# Altium schematic sheet Analog.SchDoc: Level shifters + Amplifiers
size A4; Date: 6.4.2015; Engineer: Matjaz Tome; DocumentNumber: 6; Revision: B1; SheetNumber: 6; SheetTotal: 8; Project: USB DAQ
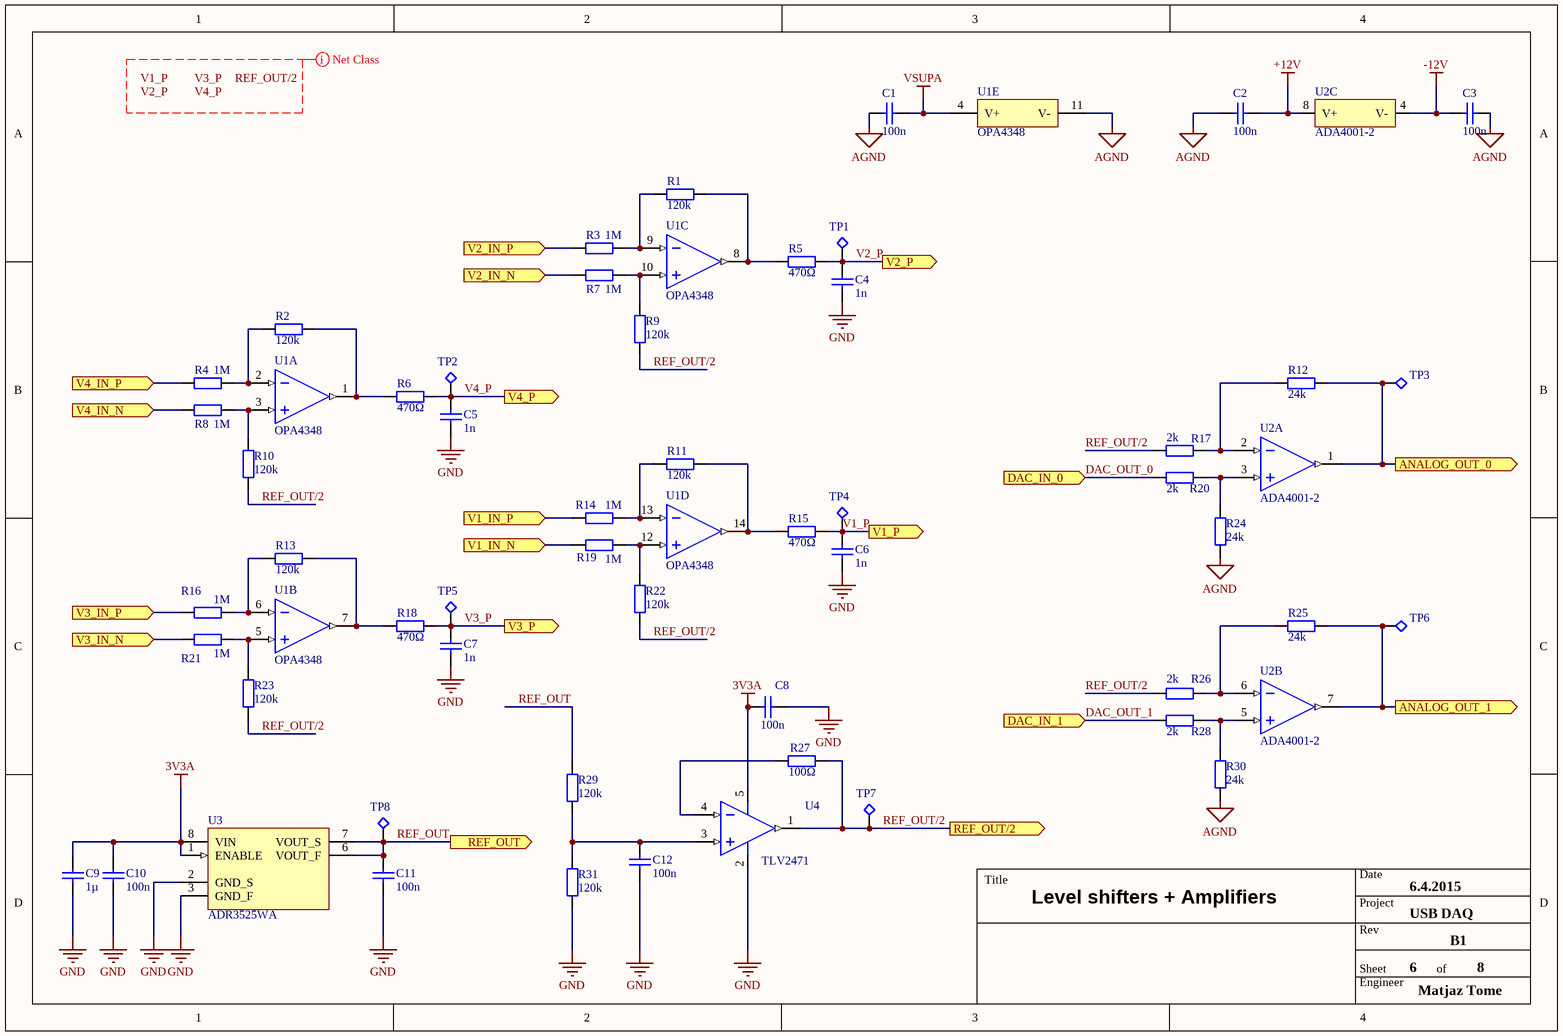
[diagram p0: Analog.SchDoc]

## Parts
C1  100n  [0603C]
C2  100n  [0603C]
C3  100n  [0603C]
C4  1n  [0603C]
C5  1n  [0603C]
C6  1n  [0603C]
C7  1n  [0603C]
C8  100n  [0603C]
C9  1µ  [0603C]
C10  100n  [0603C]
C11  100n  [0603C]
C12  100n  [0603C]
R1  120k  [0603R]
R2  120k  [0603R]
R3  1M  [0603R]
R4  1M  [0603R]
R5  470Ω  [0603R]
R6  470Ω  [0603R]
R7  1M  [0603R]
R8  1M  [0603R]
R9  120k  [0603R]
R10  120k  [0603R]
R11  120k  [0603R]
R12  24k  [0603R]
R13  120k  [0603R]
R14  1M  [0603R]
R15  470Ω  [0603R]
R16  1M  [0603R]
R17  2k  [0603R]
R18  470Ω  [0603R]
R19  1M  [0603R]
R20  2k  [0603R]
R21  1M  [0603R]
R22  120k  [0603R]
R23  120k  [0603R]
R24  24k  [0603R]
R25  24k  [0603R]
R26  2k  [0603R]
R27  100Ω  [0603R]
R28  2k  [0603R]
R29  120k  [0603R]
R30  24k  [0603R]
R31  120k  [0603R]
TP1  testpoint  [TP1_FULL]  (value not drawn)  (no BOM)
TP2  testpoint  [TP1_FULL]  (value not drawn)  (no BOM)
TP3  testpoint  [TP1_FULL]  (value not drawn)  (no BOM)
TP4  testpoint  [TP1_FULL]  (value not drawn)  (no BOM)
TP5  testpoint  [TP1_FULL]  (value not drawn)  (no BOM)
TP6  testpoint  [TP1_FULL]  (value not drawn)  (no BOM)
TP7  testpoint  [TP1_FULL]  (value not drawn)  (no BOM)
TP8  testpoint  [TP1_FULL]  (value not drawn)  (no BOM)
U1  OPA4348  [SOIC14]  (parts A,B,C,D,E of 5)
U2  ADA4001-2  [SOIC8]  (parts A,B,C of 3)
U3  ADR3525WA  [MSOP8]
U4  TLV2471  [SOT23-5]

## Ports
ANALOG_OUT_0 (out), ANALOG_OUT_1 (out), DAC_IN_0 (in), DAC_IN_1 (in), REF_OUT (out), REF_OUT/2 (out), V1_IN_N (in), V1_IN_P (in), V1_P (out), V2_IN_N (in), V2_IN_P (in), V2_P (out), V3_IN_N (in), V3_IN_P (in), V3_P (out), V4_IN_N (in), V4_IN_P (in), V4_P (out)

## Nets
3V3A: C8.2 C9.2 C10.2 U3.1(ENABLE) U3.8(VIN) U4.5(V+)
+12V: C2.1 U2.8(V+)
-12V: C3.2 U2.4(V-)
AGND: C1.2 C2.2 C3.1 R24.1 R30.1 U1.11(V-)
GND: C4.1 C5.1 C6.1 C7.1 C8.1 C9.1 C10.1 C11.1 C12.1 R31.1 U3.2(GND_S) U3.3(GND_F) U4.2(V-)
VSUPA: C1.1 U1.4(V+)
ANALOG_OUT_0: R12.2 TP3.1 U2.1(OUT) ; port ANALOG_OUT_0
ANALOG_OUT_1: R25.1 TP6.1 U2.7(OUT) ; port ANALOG_OUT_1
DAC_OUT_0: R20.1 ; port DAC_IN_0
DAC_OUT_1: R28.1 ; port DAC_IN_1
REF_OUT: C11.2 R29.2 TP8.1 U3.6(VOUT_F) U3.7(VOUT_S) ; port REF_OUT
REF_OUT/2: R9.1 R10.1 R17.1 R22.1 R23.1 R26.1 R27.2 TP7.1 U4.1(OUT_A) ; port REF_OUT/2
V1_IN_N: R19.1 ; port V1_IN_N
V1_IN_P: R14.1 ; port V1_IN_P
V1_P: C6.2 R15.2 TP4.1 ; port V1_P
V2_IN_N: R7.1 ; port V2_IN_N
V2_IN_P: R3.1 ; port V2_IN_P
V2_P: C4.2 R5.2 TP1.1 ; port V2_P
V3_IN_N: R21.1 ; port V3_IN_N
V3_IN_P: R16.1 ; port V3_IN_P
V3_P: C7.2 R18.2 TP5.1 ; port V3_P
V4_IN_N: R8.1 ; port V4_IN_N
V4_IN_P: R4.1 ; port V4_IN_P
V4_P: C5.2 R6.2 TP2.1 ; port V4_P
NetC12_2: C12.2 R29.1 R31.2 U4.3(+IN_A)
NetR1_1: R1.1 R3.2 U1.9(-IN_C)
NetR1_2: R1.2 R5.1 U1.8(OUT_C)
NetR2_1: R2.1 R4.2 U1.2(-IN_A)
NetR2_2: R2.2 R6.1 U1.1(OUT_A)
NetR7_2: R7.2 R9.2 U1.10(+IN_C)
NetR8_2: R8.2 R10.2 U1.3(+IN_A)
NetR11_1: R11.1 R14.2 U1.13(-IN_D)
NetR11_2: R11.2 R15.1 U1.14(OUT_D)
NetR12_1: R12.1 R17.2 U2.2(IN-)
NetR13_1: R13.1 R16.2 U1.6(-IN_B)
NetR13_2: R13.2 R18.1 U1.7(OUT_B)
NetR19_2: R19.2 R22.2 U1.12(+IN_D)
NetR20_2: R20.2 R24.2 U2.3(IN+)
NetR21_2: R21.2 R23.2 U1.5(+IN_B)
NetR25_2: R25.2 R26.2 U2.6(IN2-)
NetR27_1: R27.1 U4.4(-IN_A)
NetR28_2: R28.2 R30.2 U2.5(IN2+)

## Layout directives
net class ANALOG: REF_OUT/2, V1_P, V2_P, V3_P, V4_P

## Notes on the sheet
- Labels drawn without touching a wire or pin: REF_OUT/2, V1_P, V2_P, V3_P, V4_P
- Title
- Date
- Project
- Rev
- Engineer
- Sheet
- of

## Library data of the parts
C1-C3 C8 C10-C12 = RSC0013: ceramic X7R SMD capacitor smd 0603 100nF 16V; Manufacturer: Murata; Manufacturer Number: GRM188R71C104KA01D; Dealer number: 1828890; Dealer: Farnell; Tolerance: 10%; Part Number: RSC0013; Category: capacitors; Price: 0.042; Value: 100nF; Voltage: 16V; Case: 0603; Technology: SMT; Dielectric: X7R; HelpURL: U:\datasheet\cap\Murata\GRM\GRM188R71C104KA01D.pdf; Supplier 1: Farnell; Supplier Part Number 1: 1828890
C4-C7 = RSC0016: ceramic X7R SMD capacitor smd 0603 1nF 100V; Manufacturer: Kemet; Manufacturer Number: C0603C102K1RACTU; Dealer number: 1414606; Dealer: Farnell; Tolerance: 10%; Part Number: RSC0016; Category: capacitors; Price: 0.039; Value: 1nF; Voltage: 100V; Case: 0603; Technology: SMT; Dielectric: X7R; HelpURL: U:\datasheet\cap\KEMET X7R SMD.pdf; Supplier 1: Farnell; Supplier Part Number 1: 1414606; SKU: 1020100000013
C9 = ZSC0003: ceramic X5R SMD capacitor smd 0603 1µF 50V; Manufacturer: Murata; Manufacturer Number: GRM188R61H105KAALD; Tolerance: 10%; Part Number: ZSC0003; Category: capacitors; Price: 0.144; Value: 1µF; Voltage: 50V; Case: 0603; Technology: SMT; Dielectric: X5R; HelpURL: U:\datasheet\cap\Murata\GRM\GRM188R61H105KAALD.pdf; SKU: 1020300000001; Supplier part number 1: 1845736; Supplier 1: Farnell
R1 R2 R9-R11 R13 R22 R23 R29 R31 = ZRS0007: resistor smd 0603 120kΩ 0.1% 0.1w; Manufacturer: Panasonic; Manufacturer Number: ERA3AEB124V; Temperature coefficient: 25ppm; Part Number: ZRS0007; Category: resistors; Price: 0.26; Value: 120KΩ; Power: 0.1W; Tolerance: 0.1%; Case: 0603; Technology: SMT; Material: Metal film - thin / Metal film; HelpURL: U:\datasheet\res\PANASONIC_ERA.pdf; Supplier part number 1: 1577634; Supplier 1: Farnell
R3 R4 R7 R8 R14 R16 R19 R21 = ZRS0005: resistor smd 0603 1MΩ 0.1% 0.1w; Manufacturer: TE Connectivity; Manufacturer Number: CPF0603B1M0E1; Temperature coefficient: 25ppm; Part Number: ZRS0005; Category: resistors; Price: 0.36; Value: 1MΩ; Power: 0.1W; Tolerance: 0.1%; Case: 0603; Technology: SMT; Material: Metal film - thin / Metal film; HelpURL: U:\datasheet\res\TE_CONNECTIVITY_CPF.pdf; Supplier part number 1: 2331023; Supplier 1: Farnell
R5 R6 R15 R18 = XRS0039: resistor smd 0603 470Ω 5% 0.1w; Manufacturer: Multicomp; Manufacturer Number: MCMR06X471 JTL; Temperature coefficient: 100ppm; Part Number: XRS0039; Category: resistors; Price: 0.009€; Value: 470Ω; Power: 0.1W; Tolerance: 5%; Case: 0603; Technology: SMT; Material: Metal film / Metal film; HelpURL: U:\datasheet\res\MULTICOMP 0603.pdf; Supplier part number 1: 2073513; Supplier 1: Farnell
R12 R24 R25 R30 = ZRS0008: resistor smd 0603 24kΩ 0.1% 0.1w; Manufacturer: Welwyn; Manufacturer Number: PCF0603P-R-24K-BT1; Temperature coefficient: 25ppm; Part Number: ZRS0008; Category: resistors; Price: 0.194; Value: 24KΩ; Power: 0.1W; Tolerance: 0.1%; Case: 0603; Technology: SMT; Material: Metal film - thin / Metal film; HelpURL: U:\datasheet\res\WELW.pdf; Supplier part number 1: 1506034; Supplier 1: Farnell
R17 R20 R26 R28 = ZRS0001: resistor smd 0603 2kΩ 0.1% 0.1w; Manufacturer: Susumu; Manufacturer Number: RR0816P-202-B-T5; Temperature coefficient: 25ppm; Part Number: ZRS0001; Category: resistors; Price: 0.098; Value: 2KΩ; Power: 0.1W; Tolerance: 0.1%; Case: 0603; Technology: SMT; Material: Metal film - thin / Metal film; HelpURL: U:\datasheet\res\SUSUMU_RR.pdf; Supplier part number 1: 1653263; Supplier 1: Farnell
R27 = XRS0016: resistor smd 0603 100Ω 5% 0.1w; Manufacturer: Multicomp; Manufacturer Number: MCMR06X101 JTL; Temperature coefficient: 100ppm; Part Number: XRS0016; Category: resistors; Price: 0.009€; Value: 100Ω; Power: 0.1W; Tolerance: 5%; Case: 0603; Technology: SMT; Material: Metal film / Metal film; HelpURL: U:\datasheet\res\MULTICOMP 0603.pdf; Supplier part number 1: 2073352; Supplier 1: Farnell
TP1-TP8 = XXC0006: testpoint 1.5mm diameter no hole; Part Number: XXC0006; Category: testpoints
U1 = XOG0008: 1MHz, 45µA, CMOS, Rail-to-Rail OPERATIONAL AMPLIFIERS Value Line Series; Manufacturer: Texas Instruments; Manufacturer Number: OPA4348AID; Supply voltage max: 5.5V; Supply voltage min: 2.1V; Devices: 4; Rail to Rail: IN/OUT; Part Number: XOG0008; Category: Integrated circuits; Price: 1.64; GBP: 1MHz; Case: SOIC14; Technology: SMT; HelpURL: U:\datasheet\opamps\OPA348.pdf; Supplier part number 1: 2323277; Supplier 1: Farnell
U2 = XOG0003: Low Noise, Low Input Bias Current, Rail-to-Rail / Output, JFET Dual Operational Amplifier; Manufacturer: Analog devices; Manufacturer Number: ADA4001-2ARZ; Supply voltage max: 36V; Devices: 2; GBP: 16.7MHz; Slew rate: 25V/µs; Rail to Rail: IN/OUT; Part Number: XOG0003; Category: Integrated circuits; Price: 2.8; Case: SOIC8; Technology: SMT; HelpURL: U:\datasheet\opamps\ADA4001-2.pdf; Supplier part number 1: 2081044; Supplier 1: Farnell
U3 = VRX0002: Micropower, High Accuracy / Voltage References; Manufacturer: Analog devices; Manufacturer Number: ADR3525WARMZ-R7; Dealer number: 2077701; Dealer: Farnell; Output Voltage: 2.5V; Max input voltage: 5.5V; Output current: 10mA; Voltage tolerance: 0.1%; Part Number: VRX0002; Category: Integrated circuits; Price: 1.66; Case: MSOP8; Technology: SMT; HelpURL: U:\datasheet\volage_references\ADR35XX.pdf; Supplier 1: Farnell; Supplier part number 1: 2077701
U4 = XOG0002: FAMILY OF 600μA/Ch 2.8MHz RAIL-TO-RAIL INPUT/OUTPUT / HIGH-DRIVE OPERATIONAL AMPLIFIERS WITH SHUTDOWN; Manufacturer: Texas Instruments; Manufacturer Number: TLV2471IDBVT; Supply voltage max: 6V; Supply voltage min: 2.7V; Devices: 1; Rail to Rail: IN/OUT; Part Number: XOG0002; Category: Integrated circuits; Price: 1.43; GBP: 2.8MHz; Case: SOT23-5; Technology: SMT; HelpURL: U:\datasheet\opamps\TLV247x.pdf; Supplier part number 1: 1102964; Supplier 1: Farnell